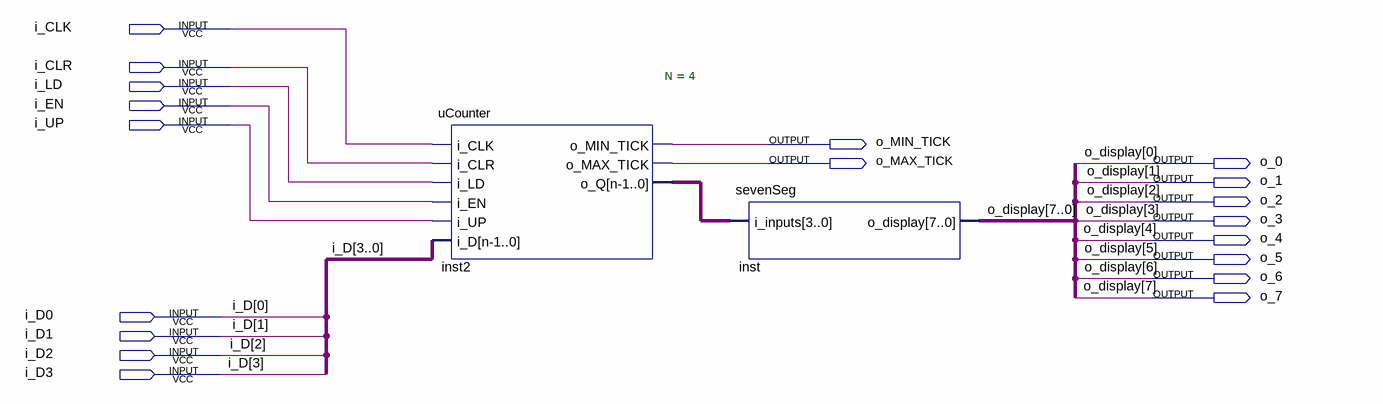
[diagram p0: schematic sheet]
// Quartus schematic SevenSeg_uCounter.bdf as structural Verilog: 2 symbols, 19 pins
module SevenSeg_uCounter (
  input  i_CLK,
  input  i_CLR,
  input  i_LD,
  input  i_EN,
  input  i_UP,
  input  i_D0,
  input  i_D1,
  input  i_D2,
  input  i_D3,
  output o_MIN_TICK,
  output o_MAX_TICK,
  output o_0,
  output o_1,
  output o_2,
  output o_3,
  output o_4,
  output o_5,
  output o_6,
  output o_7
);

  wire [3:0] inst2_o_q;

  uCounter #(.N(4)) inst2 (
    .i_CLK(i_CLK), .i_CLR(i_CLR), .i_LD(i_LD), .i_EN(i_EN), .i_UP(i_UP), .i_D({i_D3, i_D2, i_D1, i_D0}),
    .o_MIN_TICK(o_MIN_TICK), .o_MAX_TICK(o_MAX_TICK), .o_Q(inst2_o_q));
  sevenSeg inst (.i_inputs(inst2_o_q), .o_display({o_7, o_6, o_5, o_4, o_3, o_2, o_1, o_0}));

  // Other names for the same wires on the sheet: o_display[7:0] = {o_7, o_6, o_5, o_4, o_3, o_2, o_1, o_0}
endmodule
